# EAGLE schematic beaglesound_v0001 (EAGLE 6.4)
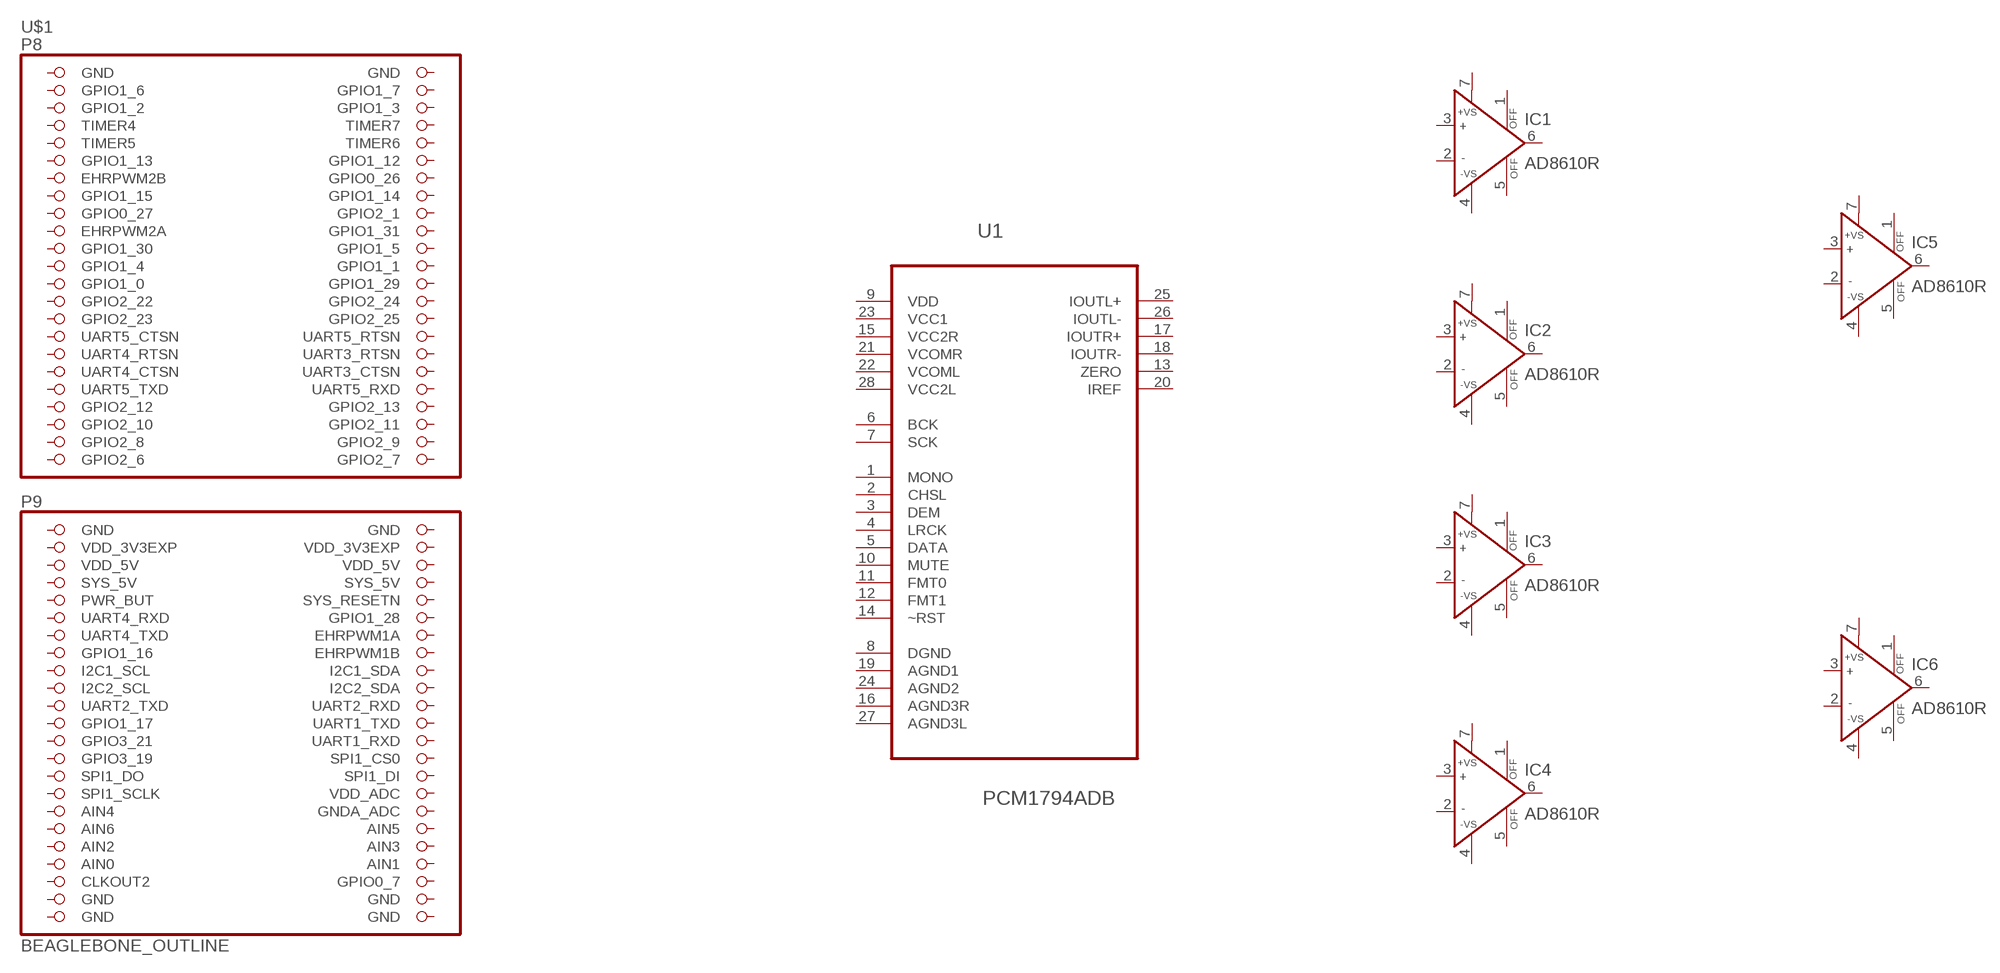
[diagram p0: schematic, sheet 1]

## Parts
IC1  AD8610R  [SO8]
IC2  AD8610R  [SO8]
IC3  AD8610R  [SO8]
IC4  AD8610R  [SO8]
IC5  AD8610R  [SO8]
IC6  AD8610R  [SO8]
U1  PCM1794ADB  [SOP65P780X200-28N]
U$1  BEAGLEBONE_OUTLINE  [BEAGLEBONE_SHIELD]
Unconnected: IC1.1(OFF) IC1.2(IN-) IC1.3(IN+) IC1.4(-VS) IC1.5(OFF) IC1.6(OUT) IC1.7(+VS) IC2.1(OFF) IC2.2(IN-) IC2.3(IN+) IC2.4(-VS) IC2.5(OFF) IC2.6(OUT) IC2.7(+VS) IC3.1(OFF) IC3.2(IN-) IC3.3(IN+) IC3.4(-VS) IC3.5(OFF) IC3.6(OUT) IC3.7(+VS) IC4.1(OFF) IC4.2(IN-) IC4.3(IN+) IC4.4(-VS) IC4.5(OFF) IC4.6(OUT) IC4.7(+VS) IC5.1(OFF) IC5.2(IN-) IC5.3(IN+) IC5.4(-VS) IC5.5(OFF) IC5.6(OUT) IC5.7(+VS) IC6.1(OFF) IC6.2(IN-) IC6.3(IN+) IC6.4(-VS) IC6.5(OFF) IC6.6(OUT) IC6.7(+VS) U1.1(MONO) U1.2(CHSL) U1.3(DEM) U1.4(LRCK) U1.5(DATA) U1.6(BCK) U1.7(SCK) U1.8(DGND) U1.10(MUTE) U1.11(FMT0) U1.12(FMT1) U1.13(ZERO) U1.14(~RST) U1.16(AGND3R) U1.17(IOUTR+) U1.18(IOUTR-) U1.19(AGND1) U1.20(IREF) U1.21(VCOMR) U1.22(VCOML) U1.24(AGND2) U1.25(IOUTL+) U1.26(IOUTL-) U1.27(AGND3L) U$1.3(GPIO1_6) U$1.4(GPIO1_7) U$1.5(GPIO1_2) U$1.6(GPIO1_3) U$1.7(TIMER4) U$1.8(TIMER7) U$1.9(TIMER5) U$1.10(TIMER6) U$1.11(GPIO1_13) U$1.12(GPIO1_12) U$1.13(EHRPWM2B) U$1.14(GPIO0_26) U$1.15(GPIO1_15) U$1.16(GPIO1_14) U$1.17(GPIO0_27) U$1.18(GPIO2_1) U$1.19(EHRPWM2A) U$1.20(GPIO1_31) U$1.21(GPIO1_30) U$1.22(GPIO1_5) U$1.23(GPIO1_4) U$1.24(GPIO1_1) U$1.25(GPIO1_0) U$1.26(GPIO1_29) U$1.27(GPIO2_22) U$1.28(GPIO2_24) U$1.29(GPIO2_23) U$1.30(GPIO2_25) U$1.31(UART5_CTSN) U$1.32(UART5_RTSN) U$1.33(UART4_RTSN) U$1.34(UART3_RTSN) U$1.35(UART4_CTSN) U$1.36(UART3_CTSN) U$1.37(UART5_TXD) U$1.38(UART5_RXD) U$1.39(GPIO2_12) U$1.40(GPIO2_13) U$1.41(GPIO2_10) U$1.42(GPIO2_11) U$1.43(GPIO2_8) U$1.44(GPIO2_9) U$1.45(GPIO2_6) U$1.46(GPIO2_7) U$1.54(SYS_5V) U$1.55(PWR_BUT) U$1.56(SYS_RESETN) U$1.57(UART4_RXD) U$1.58(GPIO1_28) U$1.59(UART4_TXD) U$1.60(EHRPWM1A) U$1.61(GPIO1_16) U$1.62(EHRPWM1B) U$1.63(I2C1_SCL) U$1.64(I2C1_SDA) U$1.65(I2C2_SCL) U$1.66(I2C2_SDA) U$1.67(UART2_TXD) U$1.68(UART2_RXD) U$1.69(GPIO1_17) U$1.70(UART1_TXD) U$1.71(GPIO3_21) U$1.72(UART1_RXD) U$1.73(GPIO3_19) U$1.74(SPI1_CS0) U$1.75(SPI1_DO) U$1.76(SPI1_DI) U$1.77(SPI1_SCLK) U$1.78(VDD_ADC) U$1.79(AIN4) U$1.80(GNDA_ADC) U$1.81(AIN6) U$1.82(AIN5) U$1.83(AIN2) U$1.84(AIN3) U$1.86(AIN1) U$1.87(CLKOUT2) U$1.88(GPIO0_7)

## Power pins joined to a net without a drawn wire
AIN0: U$1.85(AIN0)
GND: U$1.1(GND) U$1.2(GND) U$1.47(GND) U$1.48(GND) U$1.89(GND) U$1.90(GND) U$1.91(GND) U$1.92(GND)
SYS_5V: U$1.53(SYS_5V)
VCC1: U1.23(VCC1)
VCC2L: U1.28(VCC2L)
VCC2R: U1.15(VCC2R)
VDD: U1.9(VDD)
VDD_3V3EXP: U$1.49(VDD_3V3EXP) U$1.50(VDD_3V3EXP)
VDD_5V: U$1.51(VDD_5V) U$1.52(VDD_5V)

## Library data of the parts
IC1-IC6 = analog-devices:AD8610: Precision, Very Low Noise, Low Input Bias Current, Wide Bandwidth JFET Operational Amplifiers Source: http://www.analog.com/static/imported-files/data_sheets/AD8610_8620.pdf; MF: ALTERA CORPORATION; MPN: AD8610BRZ; OC_FARNELL: 8621578; OC_NEWARK: 59K6944
U1 = Texas Instruments_By_element14_Batch_1:PCM1794ADB: 24-Bit 192khz Sampling advanced segment Audio stereo digital-to-analog converter; MPN: PCM1794ADB; OC_FARNELL: 1755014; OC_NEWARK: 54K0199; PACKAGE: SSOP-28; SUPPLIER: Texas Instruments
U$1 = adafruit:BEAGLEBONE_OUTLINE: Should match A3 pinout - but not completely tested